# EAGLE schematic CheetahBooster (EAGLE 7.6.0)
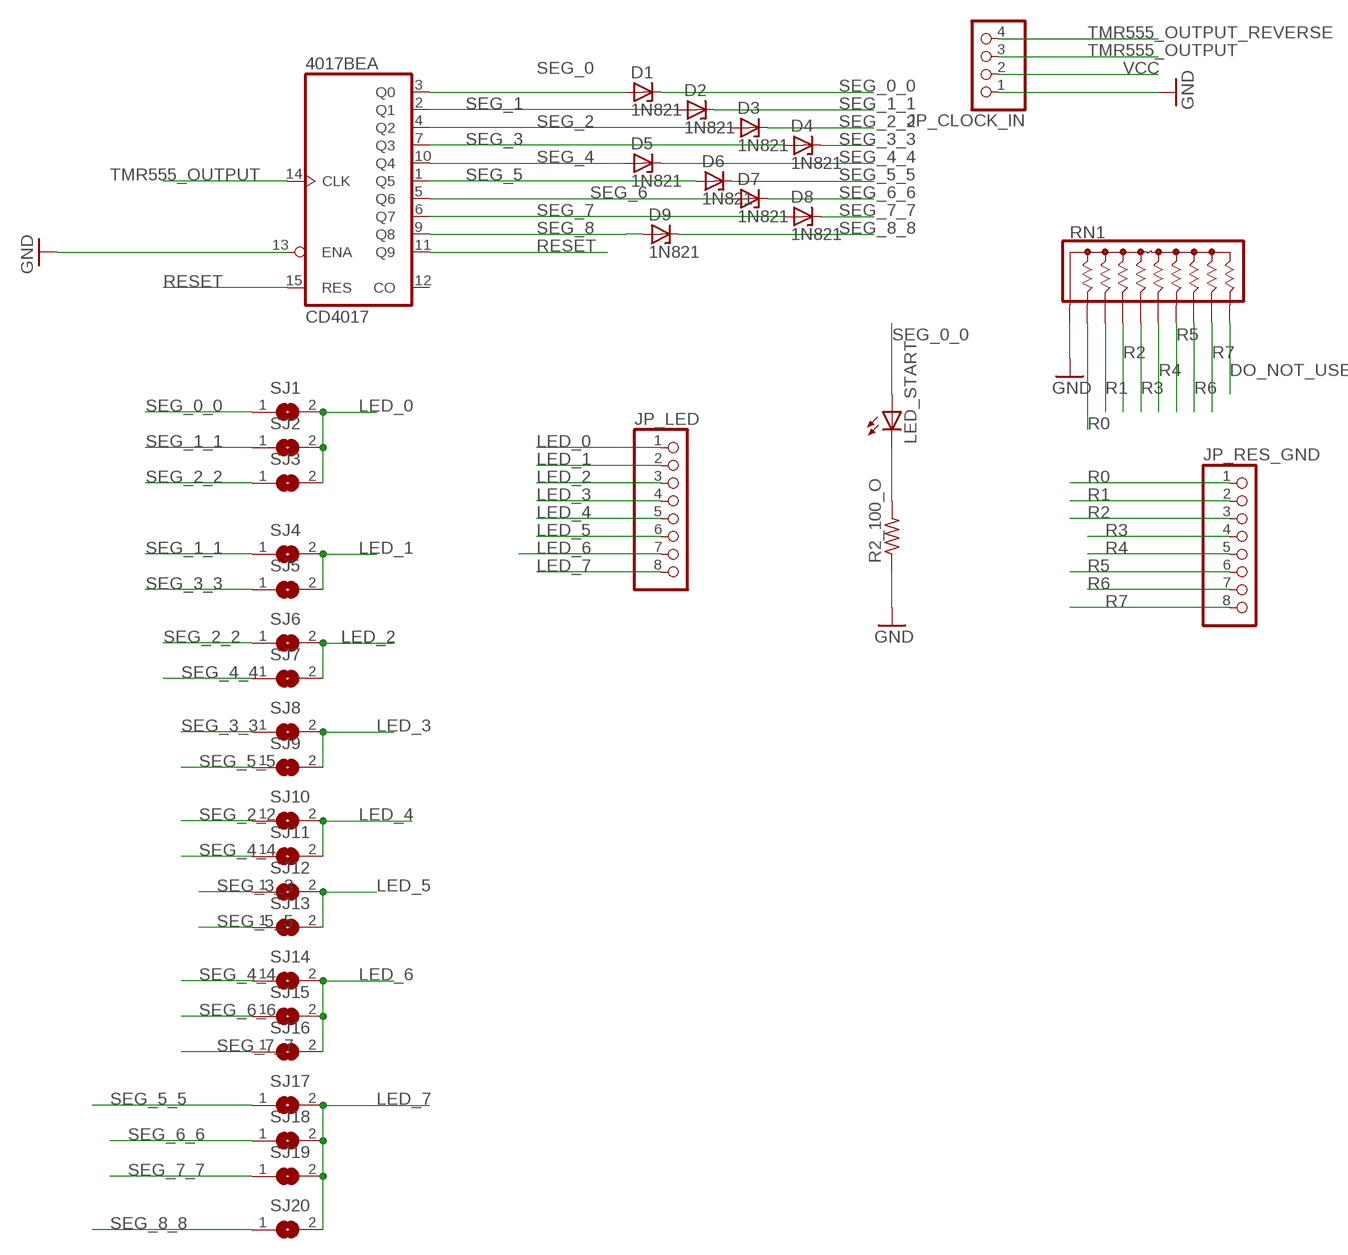
[diagram p0: schematic, sheet 1]

## Parts
4017BE  CD4017  [DIL16]
D1  1N821  [DO35Z10]
D2  1N821  [DO35Z10]
D3  1N821  [DO35Z10]
D4  1N821  [DO35Z10]
D5  1N821  [DO35Z10]
D6  1N821  [DO35Z10]
D7  1N821  [DO35Z10]
D8  1N821  [DO35Z10]
D9  1N821  [DO35Z10]
JP_CLOCK_IN  PINHD-1X4  [1X04]
JP_LED  PINHD-1X8  [1X08]
JP_RES_GND  PINHD-1X8  [1X08]
LED_START  LEDSMT1206  [1206]
R2_100_O  R-US_R1206  [R1206]
RN1  4610X  [SIP10]
SJ1  SOLDERJUMPER  [SOLDERJUMPER_ARROW_NOPASTE]
SJ2  SOLDERJUMPER  [SOLDERJUMPER_ARROW_NOPASTE]
SJ3  SOLDERJUMPER  [SOLDERJUMPER_ARROW_NOPASTE]
SJ4  SOLDERJUMPER  [SOLDERJUMPER_ARROW_NOPASTE]
SJ5  SOLDERJUMPER  [SOLDERJUMPER_ARROW_NOPASTE]
SJ6  SOLDERJUMPER  [SOLDERJUMPER_ARROW_NOPASTE]
SJ7  SOLDERJUMPER  [SOLDERJUMPER_ARROW_NOPASTE]
SJ8  SOLDERJUMPER  [SOLDERJUMPER_ARROW_NOPASTE]
SJ9  SOLDERJUMPER  [SOLDERJUMPER_ARROW_NOPASTE]
SJ10  SOLDERJUMPER  [SOLDERJUMPER_ARROW_NOPASTE]
SJ11  SOLDERJUMPER  [SOLDERJUMPER_ARROW_NOPASTE]
SJ12  SOLDERJUMPER  [SOLDERJUMPER_ARROW_NOPASTE]
SJ13  SOLDERJUMPER  [SOLDERJUMPER_ARROW_NOPASTE]
SJ14  SOLDERJUMPER  [SOLDERJUMPER_ARROW_NOPASTE]
SJ15  SOLDERJUMPER  [SOLDERJUMPER_ARROW_NOPASTE]
SJ16  SOLDERJUMPER  [SOLDERJUMPER_ARROW_NOPASTE]
SJ17  SOLDERJUMPER  [SOLDERJUMPER_ARROW_NOPASTE]
SJ18  SOLDERJUMPER  [SOLDERJUMPER_ARROW_NOPASTE]
SJ19  SOLDERJUMPER  [SOLDERJUMPER_ARROW_NOPASTE]
SJ20  SOLDERJUMPER  [SOLDERJUMPER_ARROW_NOPASTE]

## Nets
DO_NOT_USE: RN1.10
GND: 4017BE.13(A:ENA) JP_CLOCK_IN.1 R2_100_O.1 RN1.1
LED_0: JP_LED.1 SJ1.2 SJ2.2 SJ3.2
LED_1: JP_LED.2 SJ4.2 SJ5.2
LED_2: JP_LED.3 SJ6.2 SJ7.2
LED_3: JP_LED.4 SJ8.2 SJ9.2
LED_4: JP_LED.5 SJ10.2 SJ11.2
LED_5: JP_LED.6 SJ12.2 SJ13.2
LED_6: JP_LED.7 SJ14.2 SJ15.2 SJ16.2
LED_7: JP_LED.8 SJ17.2 SJ18.2 SJ19.2 SJ20.2
N$1: LED_START.C R2_100_O.2
R0: JP_RES_GND.1 RN1.2
R1: JP_RES_GND.2 RN1.3
R2: JP_RES_GND.3 RN1.4
R3: JP_RES_GND.4 RN1.5
R4: JP_RES_GND.5 RN1.6
R5: JP_RES_GND.6 RN1.7
R6: JP_RES_GND.7 RN1.8
R7: JP_RES_GND.8 RN1.9
RESET: 4017BE.11(A:Q9) 4017BE.15(A:RES)
SEG_0: 4017BE.3(A:Q0) D1.A
SEG_0_0: D1.C LED_START.A SJ1.1
SEG_1: 4017BE.2(A:Q1) D2.A
SEG_1_1: D2.C SJ2.1 SJ4.1
SEG_2: 4017BE.4(A:Q2) D3.A
SEG_2_2: D3.C SJ3.1 SJ6.1 SJ10.1
SEG_3: 4017BE.7(A:Q3) D4.A
SEG_3_3: D4.C SJ5.1 SJ8.1 SJ12.1
SEG_4: 4017BE.10(A:Q4) D5.A
SEG_4_4: D5.C SJ7.1 SJ11.1 SJ14.1
SEG_5: 4017BE.1(A:Q5) D6.A
SEG_5_5: D6.C SJ9.1 SJ13.1 SJ17.1
SEG_6: 4017BE.5(A:Q6) D7.A
SEG_6_6: D7.C SJ15.1 SJ18.1
SEG_7: 4017BE.6(A:Q7) D8.A
SEG_7_7: D8.C SJ16.1 SJ19.1
SEG_8: 4017BE.9(A:Q8) D9.A
SEG_8_8: D9.C SJ20.1
TMR555_OUTPUT: 4017BE.14(A:CLK) JP_CLOCK_IN.3
TMR555_OUTPUT_REVERSE: JP_CLOCK_IN.4
VCC: JP_CLOCK_IN.2
Unconnected: 4017BE.12(A:CO)

## Power pins joined to a net without a drawn wire
GND: 4017BE.8(P:GND)
VCC: 4017BE.16(P:VCC)

## Library data of the parts
4017BE = SparkFun-DigitalIC:CD4017; PROD_ID: IC-11929
D1-D9 = diode:1N821: Reference DIODE temperature compensated, 6,2 V
JP_CLOCK_IN = pinhead:PINHD-1X4: PIN HEADER
JP_LED JP_RES_GND = pinhead:PINHD-1X8: PIN HEADER
LED_START = adafruit:LED: LED OSRAM: - CHIPLED LG R971, LG N971, LY N971, LG Q971, LY Q971, LO R971, LY R971 LH N974, LH R974 LS Q976, LO Q976, LY Q976 LO Q996 - Hyper CHIPLED LW Q18S LB Q993, LB Q99A, LB R99A - SideLED LS A670, LO A670, LY A670, LG A670, LP A670 LB A673, LV A673, LT A673, LW A673 LH A674 LY A675 LS A676, LA A676, LO A676, LY A676, LW A676 LS A679, LY A679, LG A679 - Hyper Micro SIDELED® LS Y876, LA Y876, LO Y876, LY Y876 LT Y87S - SmartLED LW L88C, LW L88S LB L89C, LB L89S, LG L890 LS L89K, LO L89K, LY L89K LS L896, LA L896, LO L896, LY L896 - TOPLED LS T670, LO T670, LY T670, LG T670, LP T670 LSG T670, LSP T670, LSY T670, LOP T670, LYG T670 LG T671, LOG T671, LSG T671 LB T673, LV T673, LT T673, LW T673 LH T674 LS T676, LA T676, LO T676, LY T676, LB T676, LH T676, LSB T676, LW T676 LB T67C, LV T67C, LT T67C, LS T67K, LO T67K, LY T67K, LW E67C LS E67B, LA E67B, LO E67B, LY E67B, LB E67C, LV E67C, LT E67C LW T67C LS T679, LY T679, LG T679 LS T770, LO T770, LY T770, LG T770, LP T770 LB T773, LV T773, LT T773, LW T773 LH T774 LS E675, LA E675, LY E675, LS T675 LS T776, LA T776, LO T776, LY T776, LB T776 LHGB T686 LT T68C, LB T68C - Hyper Mini TOPLED® LB M676 - Mini TOPLED Santana® LG M470 LS M47K, LO M47K, LY M47K Source: http://www.osram.convergy.de/
R2_100_O = adafruit:R-US_: RESISTOR, American symbol
RN1 = resistor-sip:4610X: Bourns 4600X Series - Thick Film Conformal SIPs 4610X-101 Resistor Network Configuration: 101 (Bussed Resistors) Resistance range: 10 ohms to 10 Megaohms Maximum Operating Voltage: 100V Source: http://www.bourns.com/ProductLine.aspx?name=standard_thick_film_networks PDF: http://www.bourns.com/data/global/pdfs/4600X.pdf
SJ1-SJ20 = microbuilder:SOLDERJUMPER: SMD Solder JUMPER Solder the two pads together to create a connection, or remove the solder to break it. REFLOW - Use this footprint for solder paste and reflow ovens. WAVE - Use this footprint for hand-soldering (larger pads). CLOSED - Has a trace between the two pads to ensure it is closed by default. The trace needs to be cut to disable the jumper, and can be closed again by creating a solder bridge between the two pads.; BOM: EXCLUDE